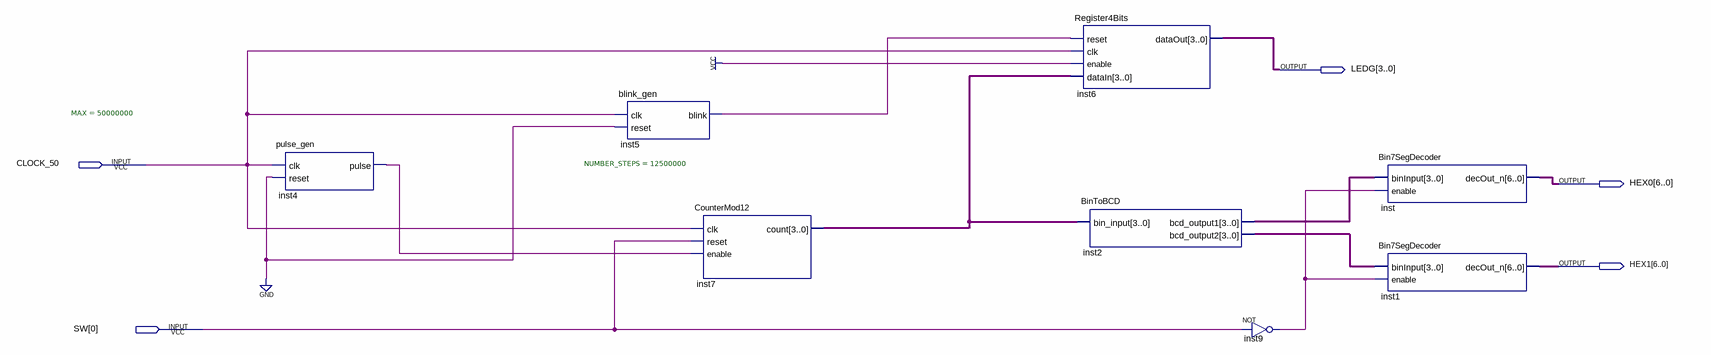
[diagram p0: schematic sheet]
// Quartus schematic MiniProjTreino.bdf as structural Verilog: 8 symbols, 5 pins
module MiniProjTreino (
  input  CLOCK_50,
  input  [0:0] SW,
  output [3:0] LEDG,
  output [6:0] HEX0,
  output [6:0] HEX1
);

  wire inst4_pulse, inst5_blink, inst9_out;
  wire [3:0] inst2_bcd_output1, inst2_bcd_output2, inst7_count;

  pulse_gen #(.MAX(50000000)) inst4 (.clk(CLOCK_50), .reset(1'b0), .pulse(inst4_pulse));
  blink_gen #(.NUMBER_STEPS(12500000)) inst5 (.clk(CLOCK_50), .reset(1'b0), .blink(inst5_blink));
  CounterMod12 inst7 (.clk(CLOCK_50), .reset(SW[0]), .enable(inst4_pulse), .count(inst7_count));
  Register4Bits inst6 (.reset(inst5_blink), .clk(CLOCK_50), .enable(1'b1), .dataIn(inst7_count), .dataOut(LEDG));
  BinToBCD inst2 (.bin_input(inst7_count), .bcd_output1(inst2_bcd_output1), .bcd_output2(inst2_bcd_output2));
  not inst9 (inst9_out, SW[0]);
  Bin7SegDecoder inst (.binInput(inst2_bcd_output1), .enable(inst9_out), .decOut_n(HEX0));
  Bin7SegDecoder inst1 (.binInput(inst2_bcd_output2), .enable(inst9_out), .decOut_n(HEX1));
endmodule
